# Altium schematic sheet MCU1.SchDoc: MCU1
size 420 x 297 mm; Address1: Address1; Address2: Address2; Address3: Address3; Address4: Address4; DocumentNumber: SSI.DB.0.001; SheetNumber: 1; Scale: 1:1; DocumentType: Схема электрическая принципиальная; FirstReferrence: АБВГ.123456.001; PageSetup: Record=PageOptions|CenterHorizontal=True|CenterVertical=True|PrintScale=1.00|XCorrection=1.00|YCorrection=1.00|PrintKind=1|BorderSize=5000000|LeftOffset=0|BottomOffset=0|Orientation=2|PaperLength=1000|PaperWidth=1000|Scale=100|PaperSource=15|PrintQuality=1200|MediaType=1|DitherType=10|PaperKind=A3|PrintScaleMode=1; Weight: -; ScaleFactor: -
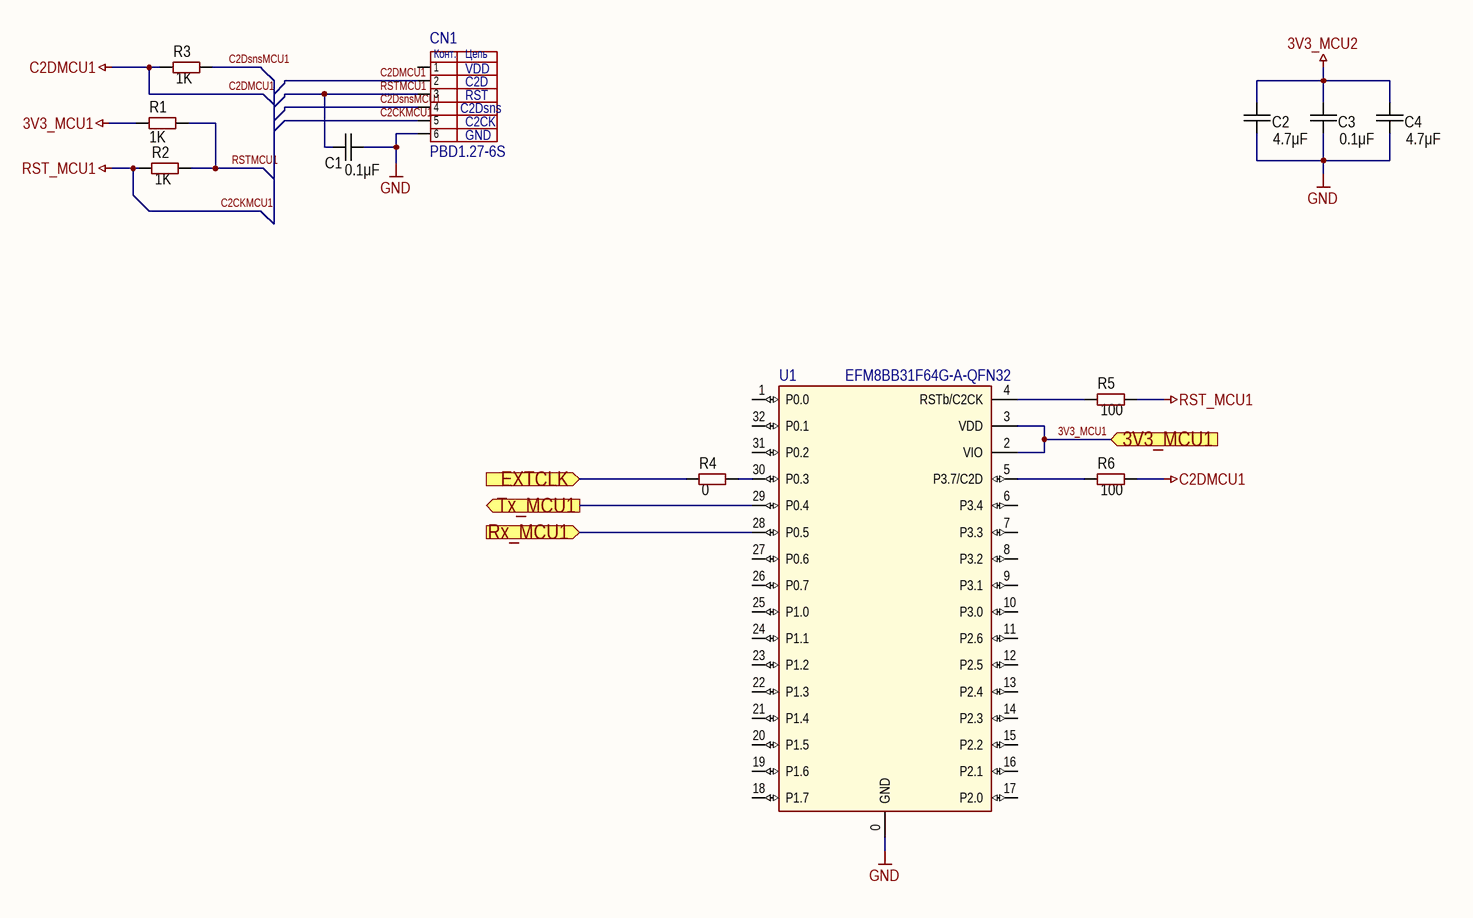
[diagram p0: MCU1.SchDoc]

## Parts
C1  value 0.1μF  [CAP: 0603]
C2  value 4.7μF  [CAP: 0603]
C3  value 0.1μF  [CAP: 0603]
C4  value 4.7μF  [CAP: 0603]
CN1  PBD1.27-6S  [CON:PBD1.27-6]
R1  value 1K  [RES: 0603]
R2  value 1K  [RES: 0603]
R3  value 1K  [RES: 0603]
R4  value 0  [RES: 0603]
R5  value 100  [RES: 0603]
R6  value 100  [RES: 0603]
U1  EFM8BB31F64G-A-QFN32  [32-QFN(4x4)]

## Ports
3V3_MCU1 (in), EXTCLK (in), Rx_MCU1 (in), Tx_MCU1 (out)

## Nets
3V3_MCU1: R1.1 U1.2(VIO) U1.3(VDD) ; port 3V3_MCU1
3V3_MCU2: C2.2 C3.2 C4.2
C2CKMCU1: CN1.5 R2.2 R5.1  [also labelled RST_MCU1]
C2DMCU1: CN1.2 R3.2 R6.1
GND: C1.1 C2.1 C3.1 C4.1 CN1.6 U1.0(GND)
C2DsnsMCU1: CN1.4 R3.1
EXTCLK: R4.2 ; port EXTCLK
RSTMCU1: C1.2 CN1.3 R1.2 R2.1
Rx_MCU1: U1.28(P0.5) ; port Rx_MCU1
Tx_MCU1: U1.29(P0.4) ; port Tx_MCU1
NetR4_1: R4.1 U1.30(P0.3)
NetR5_2: R5.2 U1.4(RSTb/C2CK)
NetR6_2: R6.2 U1.5(P3.7/C2D)

Not connected (* = marked no-connect by the designer): CN1 1; U1 1(P0.0) 6(P3.4) 7(P3.3) 8(P3.2) 9(P3.1) 10(P3.0) 11(P2.6) 12(P2.5) 13(P2.4) 14(P2.3) 15(P2.2) 16(P2.1) 17(P2.0) 18(P1.7) 19(P1.6) 20(P1.5) 21(P1.4) 22(P1.3) 23(P1.2) 24(P1.1) 25(P1.0) 26(P0.7) 27(P0.6) 31(P0.2) 32(P0.1)

## Notes on the sheet
- (near CN1) VDD
- (near CN1) C2Dsns
- (near CN1) C2D
- (near CN1) RST
- (near CN1) C2CK
- (near CN1) GND
- Перв. примен.
- Справ. №
- Подп. и дата
- Инв. № дубл.
- Взам. инв. №
- Разраб.
- Изм.
- Лист
- № докум.
- Подп.
- Дата
- Лит.
- Масса
- Масштаб
- Пров.
- Т.контр.
- Листов
- Инв. № подл.
- Утв.
- Н.контр.
- 2.106-A3
- Копировал
- Формат А3
- (in symbol PBD1.27-6S) Конт.; Цепь

## Library data of the parts
C1 C3 = Ceramic_0603: Manufacturer: Yageo; PartNumber: CC0603KRX7R7BB104; ValueManufacturerPartNumber: Ceramic capacitor, 0.1μF, X7R, ±10%, 50V, 0603, -55...+125°C; TypeCapacitor: Ceramic capacitor; Tolerance: ±10%; TypeDielectric: X7R; Voltage: 50V; Package: 0603; HelpURL: https://www.digikey.com/product-detail/en/yageo/CC0603KRX7R7BB104/311-1088-1-ND/302998; Temperature: -55...+125°C
C2 C4 = Ceramic_0603: Manufacturer: Yageo; PartNumber: CC0603KRX7R7BB104; ValueManufacturerPartNumber: Ceramic capacitor, 4.7μF, X7R, ±10%, 10V, 0603, -55...+125°C; TypeCapacitor: Ceramic capacitor; Tolerance: ±10%; TypeDielectric: X7R; Voltage: 10V; Package: 0603; HelpURL: https://www.digikey.com/product-detail/en/yageo/CC0603KRX7R7BB104/311-1088-1-ND/302998; Temperature: -55...+125°C
R1-R3 = Resistor_0603: Manufacturer: Yageo; PartNumber: RC0603JR-07100RL; ValueManufacturerPartNumber: Resistor film, 1K, ±1%, 0603, 0.1W, -55...+125°C; TypeResistor: Resistor film; Power: 0.1W; Tolerance: ±1%; Package: 0603; HelpURL: https://www.digikey.com/product-detail/en/yageo/RC0603JR-07100RL/311-100GRCT-ND/729644; Temperature: -55...+125°C
R4 = Resistor_0603: Manufacturer: Yageo; PartNumber: RC0603JR-07100RL; ValueManufacturerPartNumber: Resistor film, 0, ±1%, 0603, 0.1W, -55...+125°C; TypeResistor: Resistor film; Power: 0.1W; Tolerance: ±1%; Package: 0603; HelpURL: https://www.digikey.com/product-detail/en/yageo/RC0603JR-07100RL/311-100GRCT-ND/729644; Temperature: -55...+125°C
R5 R6 = Resistor_0603: Manufacturer: Yageo; PartNumber: RC0603JR-07100RL; ValueManufacturerPartNumber: Resistor film, 100, ±1%, 0603, 0.1W, -55...+125°C; TypeResistor: Resistor film; Power: 0.1W; Tolerance: ±1%; Package: 0603; HelpURL: https://www.digikey.com/product-detail/en/yageo/RC0603JR-07100RL/311-100GRCT-ND/729644; Temperature: -55...+125°C
U1 = EFM8BB31F64G-A-QFN32: 8051 MCU Core